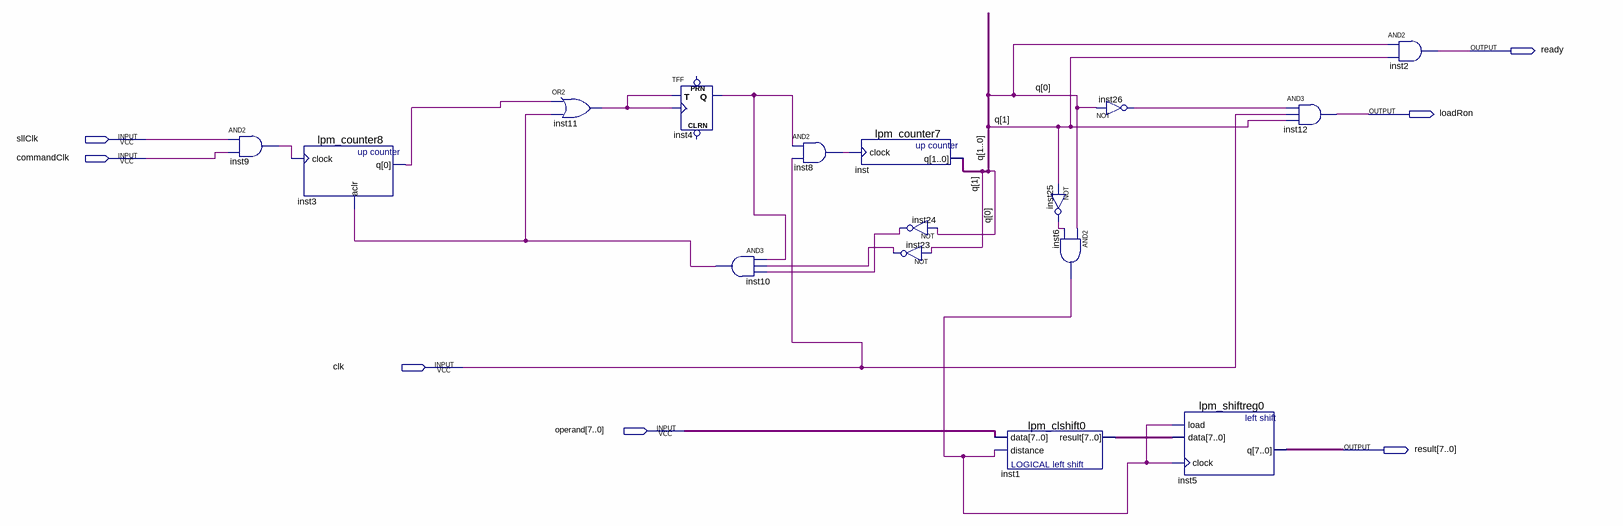
[diagram p0: schematic sheet]
// Quartus schematic SLL.bdf as structural Verilog: 16 symbols, 7 pins
module SLL (
  input  sllClk,
  input  commandClk,
  input  clk,
  input  [7:0] operand,
  output ready,
  output loadRon,
  output [7:0] result
);

  wire inst3_q, inst4_q, inst6_out, inst8_out, inst9_out, inst10_out, inst11_out, inst23_out, inst24_out,
       inst25_out, inst26_out;
  wire [1:0] q;
  wire [7:0] inst1_result;

  and inst9 (inst9_out, sllClk, commandClk);
  lpm_counter8 inst3 (.clock(inst9_out), .aclr(inst10_out), .q(inst3_q));
  or inst11 (inst11_out, inst3_q, inst10_out);
  TFF inst4 (.T(inst11_out), .CLK(inst11_out), .Q(inst4_q));  // open: PRN, CLRN
  and inst10 (inst10_out, inst4_q, inst23_out, inst24_out);
  and inst8 (inst8_out, inst4_q, clk);
  lpm_counter7 inst (.clock(inst8_out), .q(q));
  not inst24 (inst24_out, q[0]);
  not inst23 (inst23_out, q[1]);
  lpm_clshift0 inst1 (.data(operand), .distance(inst6_out), .result(inst1_result));
  not inst25 (inst25_out, q[1]);
  and inst6 (inst6_out, q[0], inst25_out);
  not inst26 (inst26_out, q[0]);
  lpm_shiftreg0 inst5 (.load(inst6_out), .data(inst1_result), .clock(inst6_out), .q(result));
  and inst12 (loadRon, inst26_out, clk, q[1]);
  and inst2 (ready, q[0], q[1]);
endmodule
